# EAGLE design PIC_Schematic (EAGLE 9.6.2)
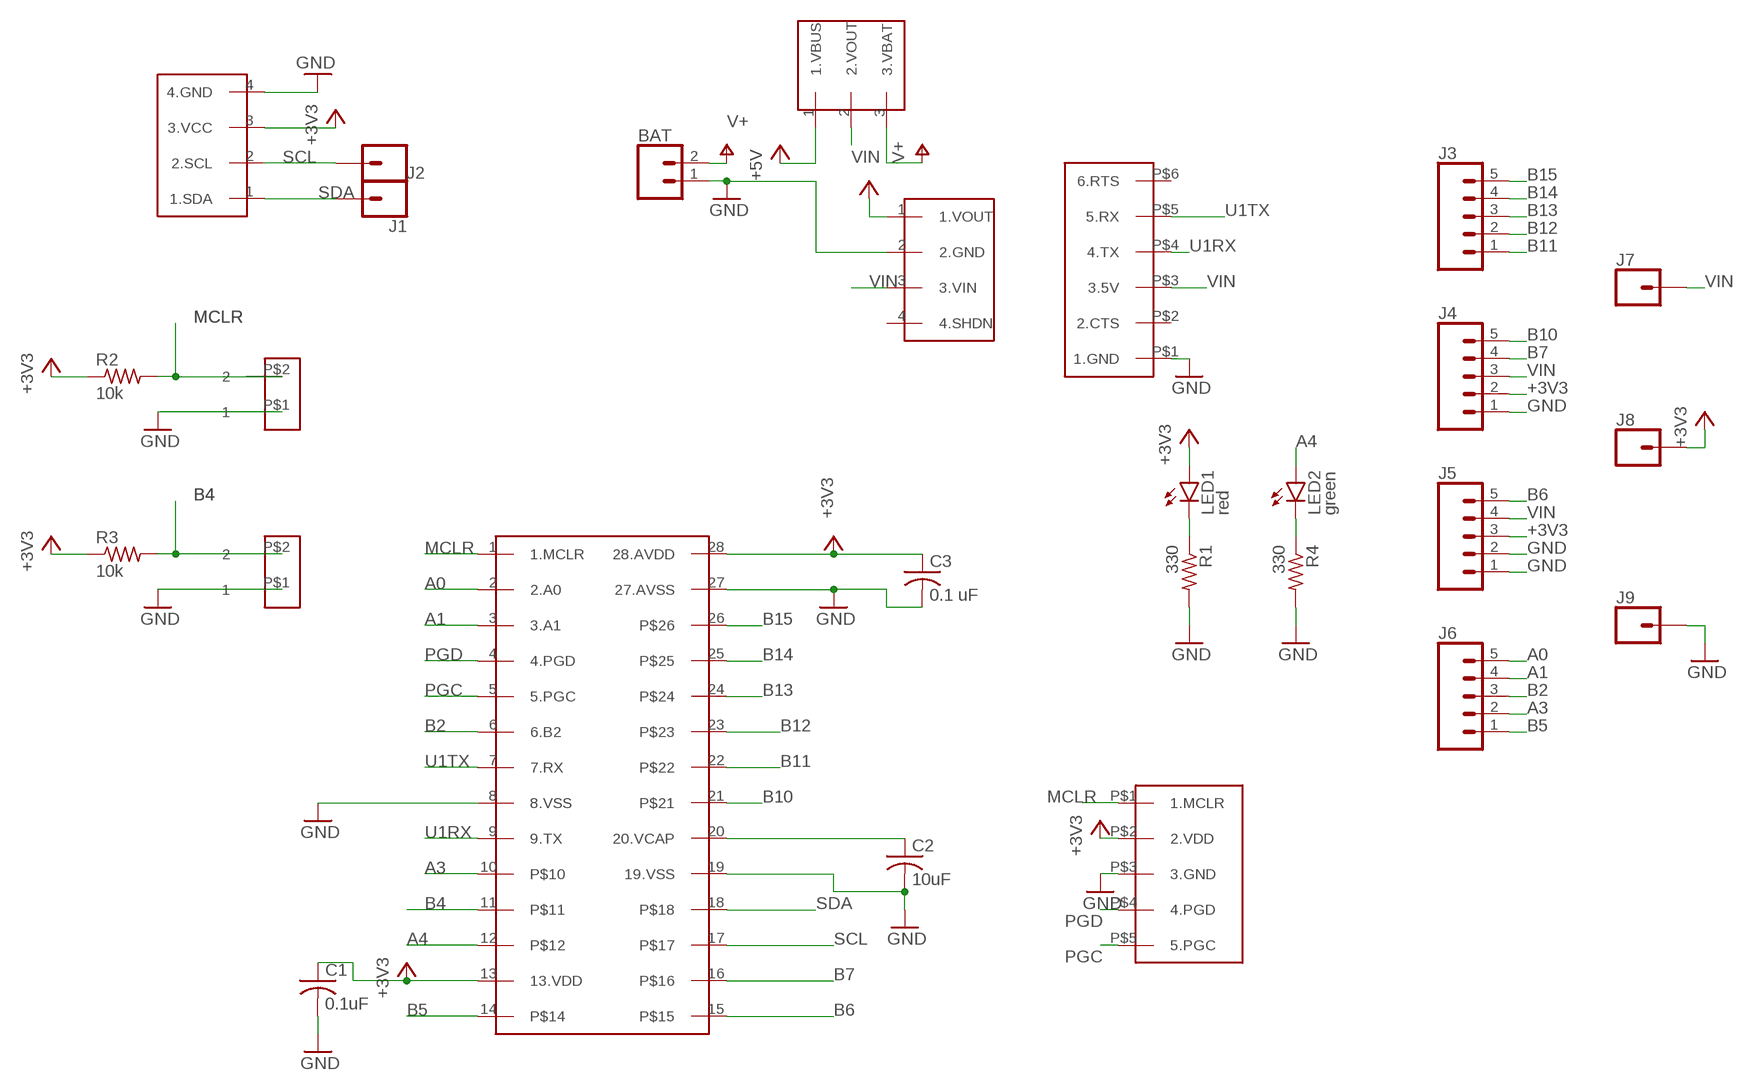
[diagram p0: schematic, sheet 1]

## Parts
BAT  CONN_02  [1X02]
C1  0.1uF  C-US025-024X044  [C025-024X044]
C2  10uF  C-US025-024X044  [C025-024X044]
C3  0.1 uF  C-US025-024X044  [C025-024X044]
J1  CONN_01  [1X01]
J2  CONN_01  [1X01]
J3  CONN_05  [1X05]
J4  CONN_05  [1X05]
J5  CONN_05  [1X05]
J6  CONN_05  [1X05]
J7  CONN_01  [1X01]
J8  CONN_01  [1X01]
J9  CONN_01  [1X01]
LED1  red  LED3MM  [LED3MM]
LED2  green  LED3MM  [LED3MM]
R1  330  R-US_0207/10  [0207/10]
R2  10k  R-US_0207/10  [0207/10]
R3  10k  R-US_0207/10  [0207/10]
R4  330  R-US_0207/10  [0207/10]
U$1  PIC32  [DIL28-3]
U$2  CP2104  [CP2104]
U$3  SLIDE  [SLIDE]
U$4  VOLTREG  [VOLTREG]
U$5  SNAP  [SNAP]
U$6  PUSH  [PUSH]
U$7  PUSH  [PUSH]
U$8  OLED  [OLED]

## Nets
+3V3: C1.1 C3.1 J4.2 J5.3 J8.1 LED1.A R2.1 R3.1 U$1.13(13.VDD) U$1.28(28.AVDD) U$4.1(1.VOUT) U$5.P$2(2.VDD) U$8.3(3.VCC)
+5V: U$3.1(1.VBUS)
A0: J6.5 U$1.2(2.A0)
A1: J6.4 U$1.3(3.A1)
A3: J6.2 U$1.10
A4: LED2.A U$1.12
B2: J6.3 U$1.6(6.B2)
B4: R3.2 U$1.11 U$7.P$2
B5: J6.1 U$1.14
B6: J5.5 U$1.15
B7: J4.4 U$1.16
B10: J4.5 U$1.21
B11: J3.1 U$1.22
B12: J3.2 U$1.23
B13: J3.3 U$1.24
B14: J3.4 U$1.25
B15: J3.5 U$1.26
GND: BAT.1 C1.2 C2.2 C3.2 J4.1 J5.1 J5.2 J9.1 R1.2 R4.2 U$1.8(8.VSS) U$1.19(19.VSS) U$1.27(27.AVSS) U$2.P$1(1.GND) U$4.2(2.GND) U$5.P$3(3.GND) U$6.P$1 U$7.P$1 U$8.4(4.GND)
MCLR: R2.2 U$1.1(1.MCLR) U$5.P$1(1.MCLR) U$6.P$2
N$1: LED2.K(C) R4.1
N$2: LED1.K(C) R1.1
N$22: C2.1 U$1.20(20.VCAP)
PGC: U$1.5(5.PGC) U$5.P$5(5.PGC)
PGD: U$1.4(4.PGD) U$5.P$4(4.PGD)
SCL: J2.1 U$1.17 U$8.2(2.SCL)
SDA: J1.1 U$1.18 U$8.1(1.SDA)
U1RX: U$1.9(9.TX) U$2.P$4(4.TX)
U1TX: U$1.7(7.RX) U$2.P$5(5.RX)
V+: BAT.2 U$3.3(3.VBAT)
VIN: J4.3 J5.4 J7.1 U$2.P$3(3.5V) U$3.2(2.VOUT) U$4.3(3.VIN)
Unconnected: U$2.P$2(2.CTS) U$2.P$6(6.RTS) U$4.4(4.SHDN)

## Library data of the parts
BAT = SparkFun-Connectors:CONN_02: Multi connection point. Often used as Generic Header-pin footprint for 0.1 inch spaced/style header connections On any of the 0.1 inch spaced packages, you can populate with these: Break Away Headers - Straight <https://www.sparkfun.com/products/116> (PRT-00116) Break Away Male Headers - Right Angle <https://www.sparkfun.com/products/553> (PRT-00553) Female Headers <https://www.sparkfun.com/products/115> (PRT-00115) Break Away Headers - Machine Pin <https://www.sparkfun.com/products/117> (PRT-00117) Break Away Female Headers - Swiss Machine Pin <https://www.sparkfun.com/products/743> (PRT-00743) For SCREWTERMINALS and SPRING TERMINALS visit here: Screw Terimnals on SparkFun.com <https://www.sparkfun.com/search/results?term=Screw+Terminals> (5mm/3.5mm/2.54mm spacing) This device is also useful as a general connection point to wire up your design to another part of your project. Our various solder wires solder well into these plated through hole pads. Hook-Up Wire - Assortment (Stranded, 22 AWG) <https://www.sparkfun.com/products/11375> (PRT-11375) Hook-Up Wire - Assortment (Solid Core, 22 AWG) <https://www.sparkfun.com/products/11367> (PRT-11367) View the entire wire category on our website here <https://www.sparkfun.com/categories/141> Special notes: Molex polarized connector foot print use with: PRT-08233 with associated crimp pins and housings. 2.54_SCREWTERM for use with PRT-10571. 3.5mm Screw Terminal footprints for PRT-08084 5mm Screw Terminal footprints for use with PRT-08432
C1-C3 = PIC:C-US: CAPACITOR, American symbol; SPICEPREFIX: C
J1 J2 J7-J9 = SparkFun-Connectors:CONN_01: Single connection point. Often used as Generic Header-pin footprint for 0.1 inch spaced/style header connections On any of the 0.1 inch spaced packages, you can populate with these: Break Away Headers - Straight <https://www.sparkfun.com/products/116> (PRT-00116) Break Away Male Headers - Right Angle <https://www.sparkfun.com/products/553> (PRT-00553) Female Headers <https://www.sparkfun.com/products/115> (PRT-00115) Break Away Headers - Machine Pin <https://www.sparkfun.com/products/117> (PRT-00117) Break Away Female Headers - Swiss Machine Pin <https://www.sparkfun.com/products/743> (PRT-00743) This device is also useful as a general connection point to wire up your design to another part of your project. Our various solder wires solder well into these plated through hole pads. Hook-Up Wire - Assortment (Stranded, 22 AWG) <https://www.sparkfun.com/products/11375> (PRT-11375) Hook-Up Wire - Assortment (Solid Core, 22 AWG) <https://www.sparkfun.com/products/11367> (PRT-11367) View the entire wire category on our website here <https://www.sparkfun.com/categories/141> Special notes: SMTSO-256-ET is a "flush mount" nut for a 4-40 screw. We mostly use this on specialty testbeds; it is a nice way to connect hardware to your PCB at an adjustable hieght. Also note, the SNAP packages are for using a snappable style connector. We sell a baggie of snaps and they are also used on two LilyPad designs: Snap Assortment - 30 pack (male and female) <https://www.sparkfun.com/products/11347> (DEV-11347) LilyPad Arduino SimpleSnap <https://www.sparkfun.com/products/10941> (DEV-10941) LilyPad SimpleSnap Protoboard <https://www.sparkfun.com/products/10940> (DEV-10940)
J3-J6 = SparkFun-Connectors:CONN_05: Multi connection point. Often used as Generic Header-pin footprint for 0.1 inch spaced/style header connections On any of the 0.1 inch spaced packages, you can populate with these: Break Away Headers - Straight <https://www.sparkfun.com/products/116> (PRT-00116) Break Away Male Headers - Right Angle <https://www.sparkfun.com/products/553> (PRT-00553) Female Headers <https://www.sparkfun.com/products/115> (PRT-00115) Break Away Headers - Machine Pin <https://www.sparkfun.com/products/117> (PRT-00117) Break Away Female Headers - Swiss Machine Pin <https://www.sparkfun.com/products/743> (PRT-00743) For SCREWTERMINALS and SPRING TERMINALS visit here: Screw Terimnals on SparkFun.com <https://www.sparkfun.com/search/results?term=Screw+Terminals> (5mm/3.5mm/2.54mm spacing) This device is also useful as a general connection point to wire up your design to another part of your project. Our various solder wires solder well into these plated through hole pads. Hook-Up Wire - Assortment (Stranded, 22 AWG) <https://www.sparkfun.com/products/11375> (PRT-11375) Hook-Up Wire - Assortment (Solid Core, 22 AWG) <https://www.sparkfun.com/products/11367> (PRT-11367) View the entire wire category on our website here <https://www.sparkfun.com/categories/141> Special notes: Molex polarized connector foot print use with SKU : PRT-08231 with associated crimp pins and housings. 1MM SMD Version SKU: PRT-10208
LED1 LED2 = PIC:LED: LED OSRAM: - CHIPLED LG R971, LG N971, LY N971, LG Q971, LY Q971, LO R971, LY R971 LH N974, LH R974 LS Q976, LO Q976, LY Q976 LO Q996 - Hyper CHIPLED LW Q18S LB Q993, LB Q99A, LB R99A - SideLED LS A670, LO A670, LY A670, LG A670, LP A670 LB A673, LV A673, LT A673, LW A673 LH A674 LY A675 LS A676, LA A676, LO A676, LY A676, LW A676 LS A679, LY A679, LG A679 - Hyper Micro SIDELED® LS Y876, LA Y876, LO Y876, LY Y876 LT Y87S - SmartLED LW L88C, LW L88S LB L89C, LB L89S, LG L890 LS L89K, LO L89K, LY L89K LS L896, LA L896, LO L896, LY L896 - TOPLED LS T670, LO T670, LY T670, LG T670, LP T670 LSG T670, LSP T670, LSY T670, LOP T670, LYG T670 LG T671, LOG T671, LSG T671 LB T673, LV T673, LT T673, LW T673 LH T674 LS T676, LA T676, LO T676, LY T676, LB T676, LH T676, LSB T676, LW T676 LB T67C, LV T67C, LT T67C, LS T67K, LO T67K, LY T67K, LW E67C LS E67B, LA E67B, LO E67B, LY E67B, LB E67C, LV E67C, LT E67C LW T67C LS T679, LY T679, LG T679 LS T770, LO T770, LY T770, LG T770, LP T770 LB T773, LV T773, LT T773, LW T773 LH T774 LS E675, LA E675, LY E675, LS T675 LS T776, LA T776, LO T776, LY T776, LB T776 LHGB T686 LT T68C, LB T68C - Hyper Mini TOPLED® LB M676 - Mini TOPLED Santana® LG M470 LS M47K, LO M47K, LY M47K Source: http://www.osram.convergy.de LUXEON: - LUMILED® LXK2-PW12-R00, LXK2-PW12-S00, LXK2-PW14-U00, LXK2-PW14-V00 LXK2-PM12-R00, LXK2-PM12-S00, LXK2-PM14-U00 LXK2-PE12-Q00, LXK2-PE12-R00, LXK2-PE12-S00, LXK2-PE14-T00, LXK2-PE14-U00 LXK2-PB12-K00, LXK2-PB12-L00, LXK2-PB12-M00, LXK2-PB14-N00, LXK2-PB14-P00, LXK2-PB14-Q00 LXK2-PR12-L00, LXK2-PR12-M00, LXK2-PR14-Q00, LXK2-PR14-R00 LXK2-PD12-Q00, LXK2-PD12-R00, LXK2-PD12-S00 LXK2-PH12-R00, LXK2-PH12-S00 LXK2-PL12-P00, LXK2-PL12-Q00, LXK2-PL12-R00 Source: www.luxeon.com KINGBRIGHT: KA-3528ASYC Source: www.kingbright.com
R1-R4 = PIC:R-US_: RESISTOR, American symbol; SPICEPREFIX: R
U$1 = PIC:PIC32
U$2 = PIC:CP2104
U$3 = PIC:SLIDE
U$4 = PIC:VOLTREG
U$5 = PIC:SNAP
U$6 U$7 = PIC:PUSH
U$8 = PIC:OLED

## Board
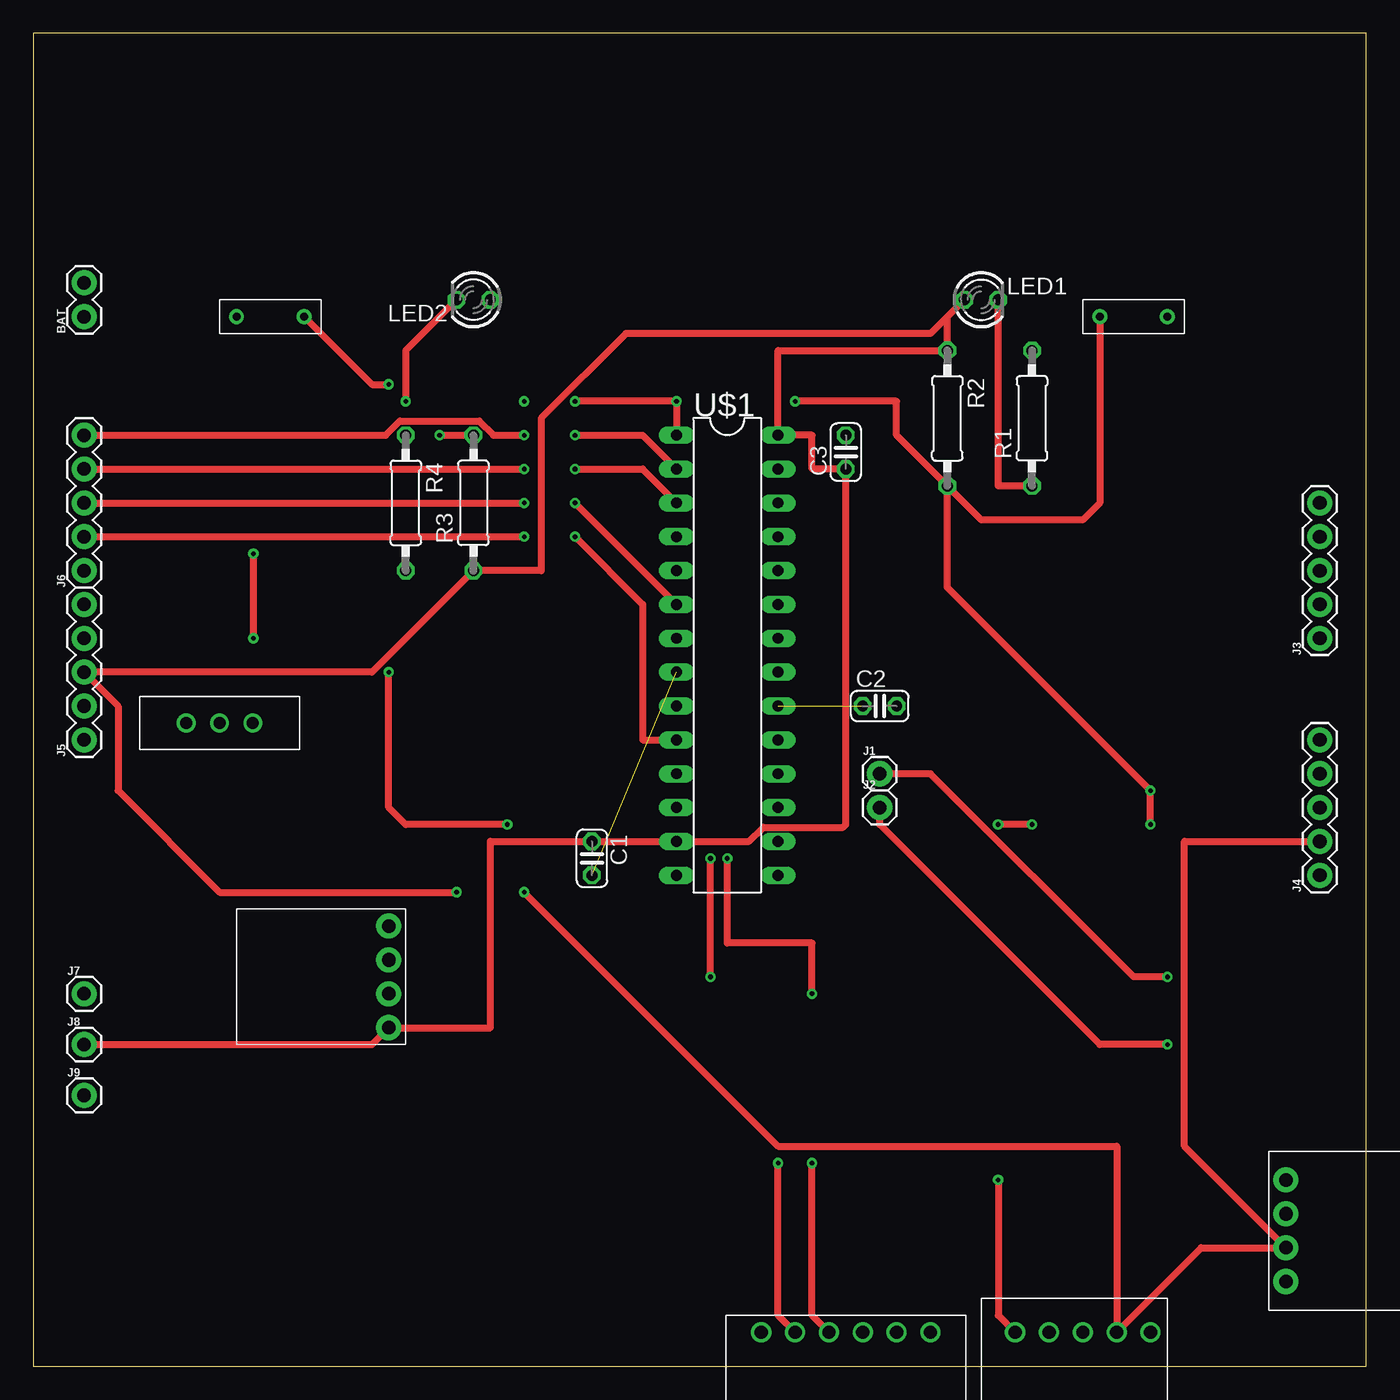
[diagram p1: board, top side]
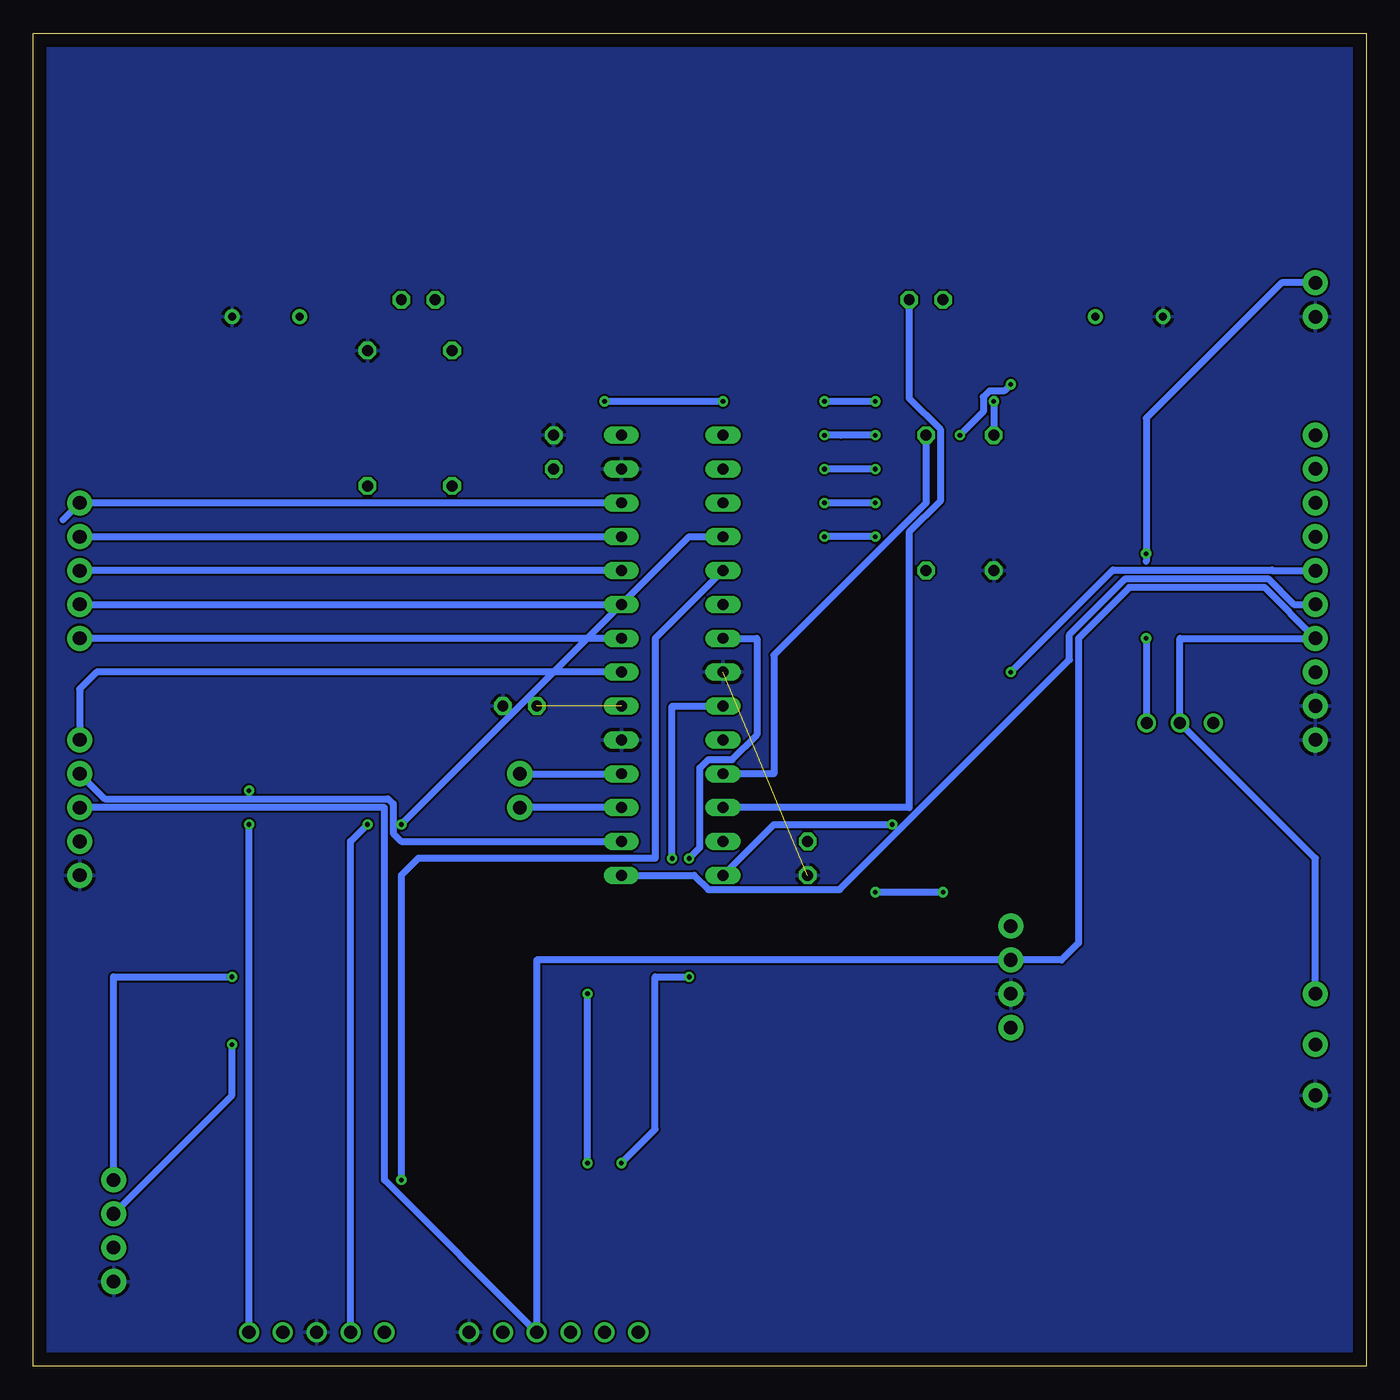
[diagram p2: board, bottom side, seen from below]

Size 100 x 100 mm. Coordinates in mm from the lower left corner, seen from the top.
Outline: 0,0 100,0 100,100 0,100 0,0
Copper layers (1*16): Top 0.035mm / dielectric 1.5mm / Bottom 0.035mm
Design rules "default": minimum track width 6mil, minimum drill 0.35mm, track to track 6mil, track to pad 6mil, pad to pad 6mil, via to via 6mil, smd to smd 6mil, copper to edge 40mil, drill to drill 6mil, minimum pad ring 10mil, minimum via ring 8mil, stop-mask expansion 4mil, vias tented up to drill 0mil, thermal gap 10mil

### Footprints (pad centres in the part's own frame; a part is rotated, then mirrored left to right if it is on the bottom)
1X02 = drill 1.016 pad 1.88: 1 0,0; 2 2.54,0
C025-024X044 = drill 0.813 octagon: 1 -1.27,0; 2 1.27,0
1X01 = drill 1.016 pad 1.88: 1 0,0
1X05 = drill 1.016 pad 1.88: 1 0,0; 2 2.54,0; 3 5.08,0; 4 7.62,0; 5 10.16,0
LED3MM = drill 0.813 octagon: A -1.27,0; K 1.27,0
0207/10 = drill 0.813 octagon: 1 -5.08,0; 2 5.08,0
DIL28-3 = drill 0.813 long: 1 -16.51,-3.81; 2 -13.97,-3.81; 3 -11.43,-3.81; 4 -8.89,-3.81; 5 -6.35,-3.81; 6 -3.81,-3.81; 7 -1.27,-3.81; 8 1.27,-3.81; 9 3.81,-3.81; 10 6.35,-3.81; 11 8.89,-3.81; 12 11.43,-3.81; 13 13.97,-3.81; 14 16.51,-3.81; 15 16.51,3.81; 16 13.97,3.81; 17 11.43,3.81; 18 8.89,3.81; 19 6.35,3.81; 20 3.81,3.81; 21 1.27,3.81; 22 -1.27,3.81; 23 -3.81,3.81; 24 -6.35,3.81; 25 -8.89,3.81; 26 -11.43,3.81; 27 -13.97,3.81; 28 -16.51,3.81
CP2104 = drill 1: P$1 0,0; P$2 2.54,0; P$3 5.08,0; P$4 7.62,0; P$5 10.16,0; P$6 12.7,0
SLIDE = drill 0.9: 1 -2.5,0; 2 0,0; 3 2.5,0
VOLTREG = drill 1.016 pad 1.88: 1 -3.81,0; 2 -3.81,2.54; 3 -3.81,5.08; 4 -3.81,7.62
SNAP = drill 1: P$1 0,0; P$2 2.54,0; P$3 5.08,0; P$4 7.62,0; P$5 10.16,0
PUSH = drill 0.6: P$1 -2.54,0; P$2 2.54,0
OLED = drill 1.016 pad 1.88: 1 -3.81,0; 2 -1.27,0; 3 1.27,0; 4 3.81,0

### Placement (x,y rotation side)
BAT  3.81,78.74 90 top
C1  41.91,38.1 270 top
C2  63.5,49.53 0 top
C3  60.96,68.58 90 top
J1  63.5,44.45 0 top
J2  63.5,41.91 0 top
J3  96.52,54.61 90 top
J4  96.52,36.83 90 top
J5  3.81,46.99 90 top
J6  3.81,59.69 90 top
J7  3.81,27.94 0 top
J8  3.81,24.13 0 top
J9  3.81,20.32 0 top
LED1  71.12,80.01 0 top
LED2  33.02,80.01 180 top
R1  74.93,71.12 90 top
R2  68.58,71.12 270 top
R3  33.02,64.77 90 top
R4  27.94,64.77 270 top
U$1  52.07,53.34 270 top
U$2  67.31,2.54 180 top
U$3  13.97,48.26 0 top
U$4  30.48,25.4 0 top
U$5  83.82,2.54 180 top
U$6  82.55,78.74 180 top
U$7  17.78,78.74 0 top
U$8  93.98,10.16 270 top

### Tracks (layer width: path | path; a pad name or v marks a point on that pad's centre or on a via)
+3V3  (via drill 0.35)
  Top 0.508: J8.1 25.4,24.13 U$4.1 34.29,25.4 34.29,39.37 C1.1 U$1.13 53.71,39.37 54.78,40.44 60.76,40.44 60.96,40.64 C3.1 58.42,67.31 58.42,69.85 U$1.28 55.88,76.2 R2.1 68.58,78.74 LED1.A 67.31,77.47 44.45,77.47 38.1,71.12 38.1,59.69 R3.1 25.4,52.07 J5.3 6.35,49.53 6.35,43.18 13.97,35.56 v31.75,35.56 | v36.83,35.56 55.88,16.51 81.28,16.51 U$5.P$2 87.63,8.89 U$8.3 86.36,16.51 86.36,39.37 J4.2
  Bottom 0.508: v31.75,35.56 v36.83,35.56
A0  (via drill 0.35)
  Top 0.508: J6.5 26.43,69.85 27.5,70.92 33.46,70.92 34.53,69.85 v36.83,69.85 | v40.64,69.85 45.72,69.85 U$1.2
  Bottom 0.508: 39.37,69.85 v36.83,69.85 v40.64,69.85
A1  (via drill 0.35)
  Top 0.508: J6.4 v36.83,67.31 | v40.64,67.31 45.72,67.31 U$1.3
  Bottom 0.508: v36.83,67.31 v40.64,67.31
A3  (via drill 0.35)
  Top 0.508: J6.2 v36.83,62.23 | v40.64,62.23 45.72,57.15 45.72,46.99 U$1.10
  Bottom 0.508: v36.83,62.23 v40.64,62.23
A4
  Bottom 0.508: LED2.A 34.29,72.63 31.95,70.29 31.95,64.9 34.29,62.57 34.29,41.91 U$1.12
B2  (via drill 0.35)
  Top 0.508: J6.3 v36.83,64.77 | v40.64,64.77 U$1.6
  Bottom 0.508: v36.83,64.77 v40.64,64.77
B4  (via drill 0.35)
  Top 0.508: U$7.P$2 25.4,73.66 v26.67,73.66 | v30.48,69.85 R3.2
  Bottom 0.508: R3.2 33.02,64.77 44.45,53.34 44.45,44.45 U$1.11 | v26.67,73.66 27.16,73.17 28.27,73.17 28.73,72.72 28.73,71.61 v30.48,69.85
B5  (via drill 0.35)
  Top 0.508: v35.56,40.64 27.94,40.64 26.67,41.91 v26.67,52.07
  Bottom 0.508: U$1.14 44.45,40.64 v35.56,40.64 | J6.1 7.02,59.69 7.07,59.74 19,59.74 v26.67,52.07
B6
  Bottom 0.508: U$1.15 50.43,36.83 49.36,35.76 39.5,35.76 22.25,53.02 22.25,54.88 18.05,59.08 7.35,59.08 5.42,57.15 J5.5
B7
  Bottom 0.508: J4.4 94.64,42.57 73.39,42.57 73,42.18 73,39.98 72.39,39.37 U$1.16
B10
  Bottom 0.508: U$1.21 95.25,52.07 96.52,50.8 J4.5
B11
  Bottom 0.508: U$1.22 J3.1
B12
  Bottom 0.508: J3.2 U$1.23
B13
  Bottom 0.508: U$1.24 J3.3
B14
  Bottom 0.508: J3.4 U$1.25
B15
  Bottom 0.508: U$1.26 J3.5 97.79,63.5
GND  (1 unrouted)
  pour Bottom: 0,0 100.33,0 100.33,100.33 0,100.33
MCLR  (via drill 0.35)
  Top 0.508: R2.2 64.77,69.85 64.77,72.39 v57.15,72.39 | U$1.1 v48.26,72.39 v40.64,72.39 | v83.82,40.64 v83.82,43.18 68.58,58.42 R2.2 | U$6.P$2 80.01,64.77 78.74,63.5 71.12,63.5 R2.2
  Bottom 0.508: v57.15,72.39 v48.26,72.39 | v40.64,72.39 v36.83,72.39 | U$5.P$1 v83.82,40.64
N$1  (via drill 0.35)
  Top 0.508: LED2.K 27.94,76.2 v27.94,72.39
  Bottom 0.508: v27.94,72.39 R4.1
N$2
  Top 0.508: R1.1 72.39,66.04 LED1.K
N$22  (1 unrouted)
PGC  (via drill 0.35)
  Top 0.508: v72.39,13.97 72.39,3.81 U$5.P$5
  Bottom 0.508: U$1.5 53.34,54.61 53.34,38.1 71.12,38.1 72.39,36.83 v72.39,13.97
PGD  (via drill 0.35)
  Top 0.508: v74.93,40.64 v72.39,40.64
  Bottom 0.508: U$5.P$4 76.2,39.37 v74.93,40.64 | v72.39,40.64 50.8,62.23 U$1.4
SCL  (via drill 0.35)
  Top 0.508: v85.09,24.13 80.01,24.13 63.5,40.64 J2.1
  Bottom 0.508: U$1.17 J2.1 | U$8.2 85.09,20.32 v85.09,24.13
SDA  (via drill 0.35)
  Top 0.508: v85.09,29.21 82.55,29.21 67.31,44.45 J1.1
  Bottom 0.508: J1.1 U$1.18 | U$8.1 93.98,29.21 v85.09,29.21
U1RX  (via drill 0.35)
  Top 0.508: U$2.P$4 58.42,3.81 v58.42,15.24 | v58.42,27.94 58.42,31.75 52.07,31.75 v52.07,38.1
  Bottom 0.508: v58.42,15.24 v58.42,27.94 | v52.07,38.1 52.07,49.53 U$1.9
U1TX  (via drill 0.35)
  Top 0.508: U$2.P$5 55.88,3.81 v55.88,15.24 | v50.8,29.21 v50.8,38.1
  Bottom 0.508: v55.88,15.24 53.34,17.78 53.34,29.21 v50.8,29.21 | v50.8,38.1 49.99,38.91 49.99,44.89 49.36,45.52 47.56,45.52 45.72,47.36 45.72,54.61 U$1.7
V+  (via drill 0.35)
  Top 0.508: v16.51,60.96 v16.51,54.61
  Bottom 0.508: BAT.2 6.35,81.28 16.51,71.12 v16.51,60.96 16.51,60.4 | v16.51,54.61 16.51,48.3 U$3.3
VIN
  Bottom 0.508: J7.1 3.81,38.1 U$3.2 13.97,54.61 J5.4 7.62,58.42 17.78,58.42 21.59,54.61 21.59,31.75 22.86,30.48 U$4.3 62.23,30.48 U$2.P$3 73.66,13.97 73.66,41.91 J4.3